# Altium schematic sheet 2015_AlimBeaconEye.SchDoc
size A4
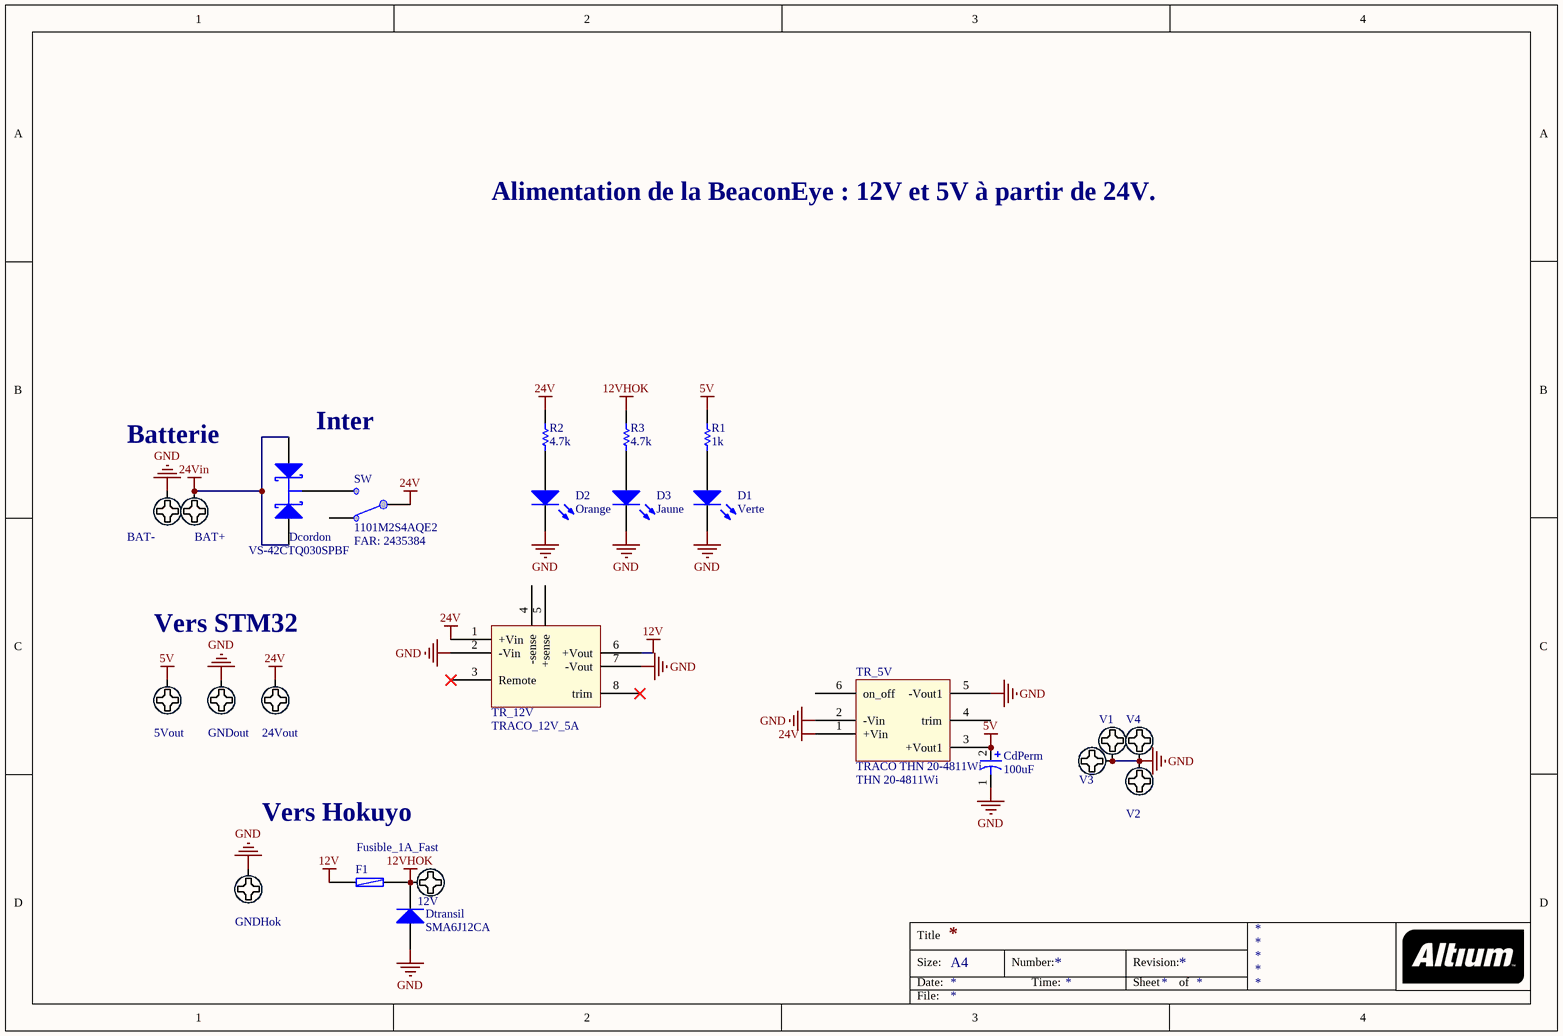
[diagram p0: 2015_AlimBeaconEye.SchDoc]

## Parts
5Vout  Pad_M3  [M3x6mm]  (value not drawn)
12V  Pad_M3  [M3x6mm]  (value not drawn)
24Vout  Pad_M3  [M3x6mm]  (value not drawn)
BAT+  Pad_M3  [M3x6mm]  (value not drawn)
BAT-  Pad_M3  [M3x6mm]  (value not drawn)
CdPerm  100uF  [CONDENSATEUR_POLARISE_ELECTROLYTIQUE_RADIAL_5.08/8.9]
D1  Verte  [LED_0805]
D2  Orange  [LED_0805]
D3  Jaune  [LED_0805]
Dcordon  VS-42CTQ030SPBF  [D2Pak (123)]
Dtransil  SMA6J12CA  [DO214AC]
F1  Fusible_1A_Fast  [R0805_N]
GNDHok  Pad_M3  [M3x6mm]  (value not drawn)
GNDout  Pad_M3  [M3x6mm]  (value not drawn)
R1  1k  [R1206_N]
R2  4.7k  [R1206_N]
R3  4.7k  [R1206_N]
SW  1101M2S4AQE2  FAR: 2435384  [SW_UNIPOL_DROIT - APEM 18235]
TR_5V  TRACO THN 20-4811Wi  Ref: THN 20-4811Wi  [TRACO_THN20]
TR_12V  TRACO_12V_5A  [TRACO_SIMPLE_12V_5A]
V1  Pad_M3  [M3x6mm]  (value not drawn)
V2  Pad_M3  [M3x6mm]  (value not drawn)
V3  Pad_M3  [M3x6mm]  (value not drawn)
V4  Pad_M3  [M3x6mm]  (value not drawn)

## Nets
5V: 5Vout.1 CdPerm.2 R1.1 TR_5V.3(+Vout1)
12V: F1.1 TR_12V.6(+Vout)
12VHOK: 12V.1 Dtransil.2(K) F1.2 R3.1
24V: 24Vout.1 R2.1 SW.COMMON1 TR_5V.1(+Vin) TR_12V.1(+Vin)
24Vin: BAT+.1 Dcordon.1(A1) Dcordon.3(A2)
GND: BAT-.1 CdPerm.1 D1.2(K) D2.2(K) D3.2(K) Dtransil.1(A) GNDHok.1 GNDout.1 TR_5V.2(-Vin) TR_5V.5(-Vout1) TR_12V.2(-Vin) TR_12V.7(-Vout) V1.1 V2.1 V3.1 V4.1
NetD1_1: D1.1(A) R1.2
NetD2_1: D2.1(A) R2.2
NetD3_1: D3.1(A) R3.2
NetDcordon_2: Dcordon.2(K) SW.NO1

Not connected (* = marked no-connect by the designer): SW NC1; TR_5V 4(trim) 6(on_off); TR_12V 3(Remote)* 4(-sense) 5(+sense) 8(trim)

## Notes on the sheet
- Alimentation de la BeaconEye : 12V et 5V à partir de 24V.
- Batterie
- (near Dcordon) Inter
- Vers STM32
- Vers Hokuyo
- Title
- Size:
- Date:
- A4
- Number:
- Time:
- Revision:
- Sheet
- of
- File:

## Library data of the parts
5Vout 12V 24Vout BAT+ BAT- GNDHok GNDout V1-V4 = Vis M3 X 6mm _TORX_Tête 6mm: Publisher: Damien Guitton
CdPerm = Condensateur Polarise Traversant: Polarized Capacitor
D1-D3 = LED: Typical LED; Published: 8-Jun-2000; LatestRevisionDate: 08-Jul-2005; LatestRevisionNote: Mech Layer 1 removed.; PackageReference: LED-1; Publisher: Altium Limited
Dcordon = Diode Shottky double BAT54C: DIODE SCHOTTKY DOUBLE; Manufacturer Part Number: BAT54C; Manufacturer: ZETEX; Diode Case Style: SOT-23; Supplier Part Number: 9526501; Supplier: Farnell; ComponentLink1URL: http://www.farnell.com/datasheets/27632.pdf; ComponentLink1Description: http://www.farnell.com/datasheets/27632.pdf; Pricing: 5=0,32, 25=0,23, 100=0,198, 1000=0,154 (EUR); RoHS: YES
Dtransil = Diode 1N4001: 1 Amp General Purpose Rectifier; Published: 8-Jun-2000; LatestRevisionDate: 17-Jul-2002; LatestRevisionNote: Re-released for DXP Platform.; DatasheetVersion: 1998; PackageVersion: Aug-1999; PackageReference: DO-41; Publisher: Altium Limited; Code_JEDEC: DO-204-AL; ComponentLink1Description: Manufacturer Link; ComponentLink1URL: http://www.fairchildsemi.com/; ComponentLink2Description: Datasheet; ComponentLink2URL: http://www.fairchildsemi.com/ds/1N%2F1N4001.pdf
F1 = Fusible_SMD: Fuse; Published: 8-Jun-2000; LatestRevisionDate: 17-Jul-2002; LatestRevisionNote: Re-released for DXP Platform.; PackageReference: PIN-W2/E2.8; Publisher: Altium Limited
R1-R3 = Resistor: Published: 8-Jun-2000; LatestRevisionDate: 17-Jul-2002; LatestRevisionNote: Re-released for DXP Platform.; PackageReference: AXIAL-0.5; Publisher: Altium Limited
SW = SW SPDT- APEM Série 523x: Switch unipolaire a levier
TR_5V = TRACO THN 20-4811Wi: Traco 20W 24V to 5V*4A